# EAGLE design sequencer_gate_LED_addon (EAGLE 5.07)
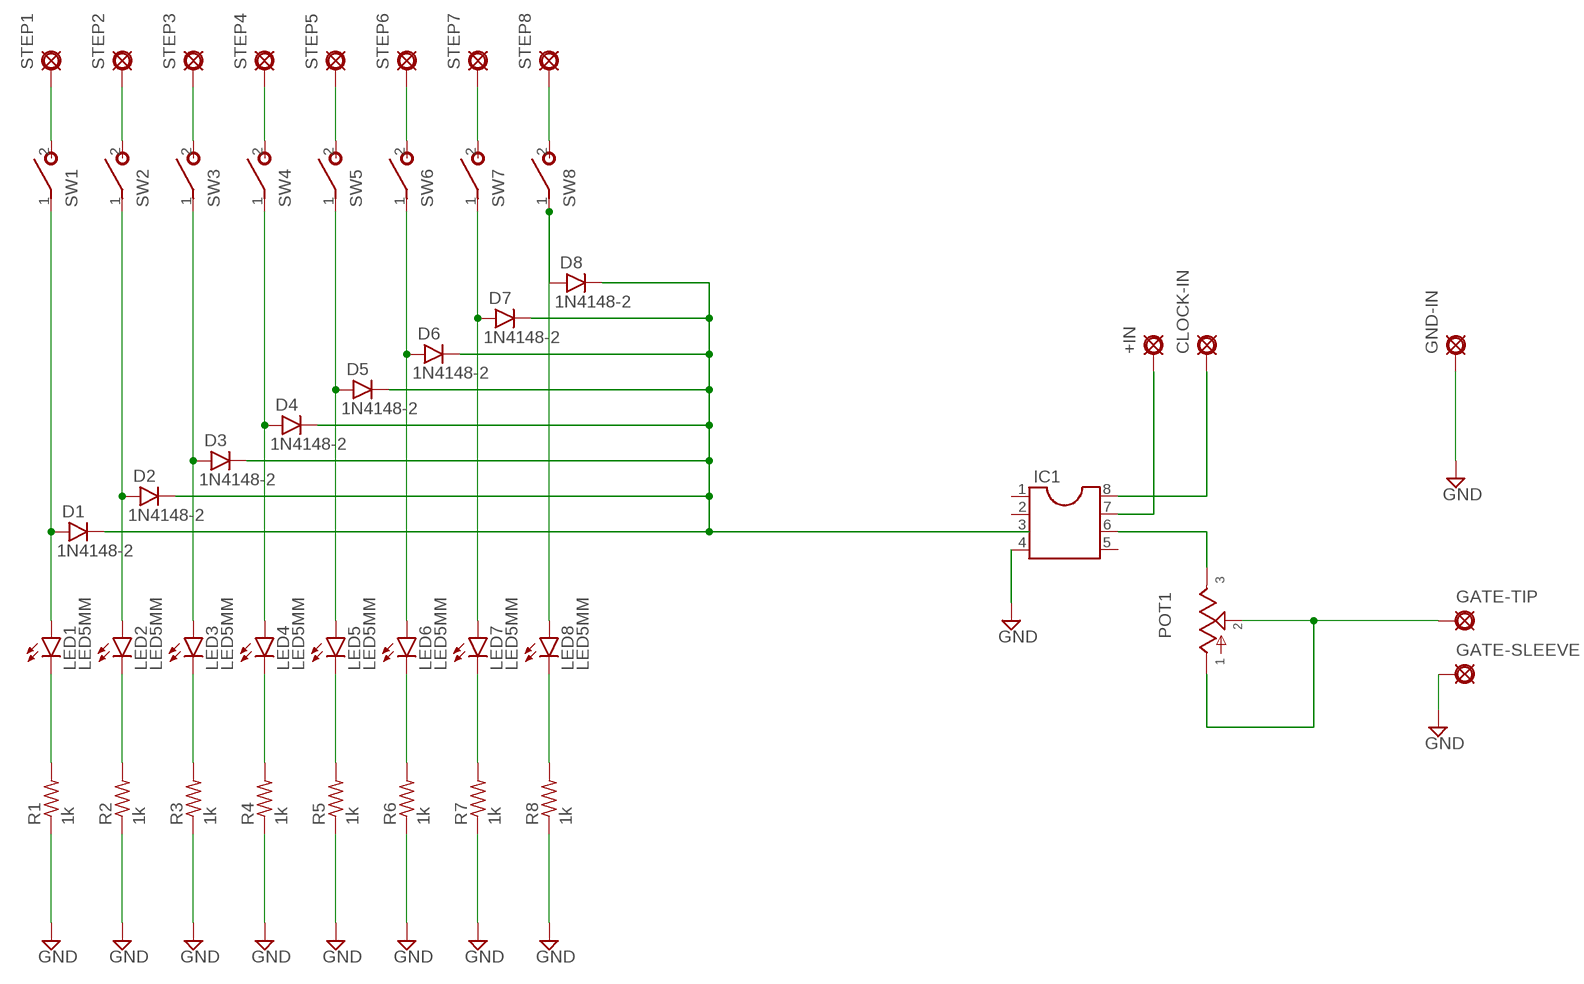
[diagram p0: schematic, sheet 1]

## Parts
+IN  PAD  [SQUARE]
CLOCK-IN  PAD  [SQUARE]
D1  1N4148-2  [DO35-2]
D2  1N4148-2  [DO35-2]
D3  1N4148-2  [DO35-2]
D4  1N4148-2  [DO35-2]
D5  1N4148-2  [DO35-2]
D6  1N4148-2  [DO35-2]
D7  1N4148-2  [DO35-2]
D8  1N4148-2  [DO35-2]
GATE-SLEEVE  PAD8  [OCTOGON]
GATE-TIP  PAD  [SQUARE]
GND-IN  PAD8  [OCTOGON]
IC1  DIL8  [DIL08]
LED1  LED5MM  [LED5MM]
LED2  LED5MM  [LED5MM]
LED3  LED5MM  [LED5MM]
LED4  LED5MM  [LED5MM]
LED5  LED5MM  [LED5MM]
LED6  LED5MM  [LED5MM]
LED7  LED5MM  [LED5MM]
LED8  LED5MM  [LED5MM]
POT1  POT  [POT]
R1  1k  3MM.2  [R0204/2]
R2  1k  3MM.2  [R0204/2]
R3  1k  3MM.2  [R0204/2]
R4  1k  3MM.2  [R0204/2]
R5  1k  3MM.2  [R0204/2]
R6  1k  3MM.2  [R0204/2]
R7  1k  3MM.2  [R0204/2]
R8  1k  3MM.2  [R0204/2]
STEP1  PAD  [SQUARE]
STEP2  PAD  [SQUARE]
STEP3  PAD  [SQUARE]
STEP4  PAD  [SQUARE]
STEP5  PAD  [SQUARE]
STEP6  PAD  [SQUARE]
STEP7  PAD  [SQUARE]
STEP8  PAD  [SQUARE]
SW1  SPST  [SPST]
SW2  SPST  [SPST]
SW3  SPST  [SPST]
SW4  SPST  [SPST]
SW5  SPST  [SPST]
SW6  SPST  [SPST]
SW7  SPST  [SPST]
SW8  SPST  [SPST]

## Nets
D10: D2.A LED2.A SW2.1(P)
GND: GATE-SLEEVE.1(PAD) GND-IN.1(PAD) IC1.4 R1.1 R2.1 R3.1 R4.1 R5.1 R6.1 R7.1 R8.1
N$1: STEP3.1(PAD) SW3.2(S)
N$2: D3.A LED3.A SW3.1(P)
N$3: LED3.K(C) R3.2
N$4: STEP4.1(PAD) SW4.2(S)
N$5: D4.A LED4.A SW4.1(P)
N$6: LED4.K(C) R4.2
N$7: STEP5.1(PAD) SW5.2(S)
N$8: D5.A LED5.A SW5.1(P)
N$9: LED5.K(C) R5.2
N$10: STEP6.1(PAD) SW6.2(S)
N$11: D6.A LED6.A SW6.1(P)
N$12: LED6.K(C) R6.2
N$13: STEP7.1(PAD) SW7.2(S)
N$14: D7.A LED7.A SW7.1(P)
N$15: LED7.K(C) R7.2
N$16: STEP8.1(PAD) SW8.2(S)
N$17: D8.A LED8.A SW8.1(P)
N$18: LED8.K(C) R8.2
N$19: STEP1.1(PAD) SW1.2(S)
N$20: D1.A LED1.A SW1.1(P)
N$21: LED1.K(C) R1.2
N$22: STEP2.1(PAD) SW2.2(S)
N$24: LED2.K(C) R2.2
N$25: D1.C D2.C D3.C D4.C D5.C D6.C D7.C D8.C IC1.3
N$26: +IN.1(PAD) IC1.7
N$28: IC1.6 POT1.3
N$29: GATE-TIP.1(PAD) POT1.1 POT1.2
N$30: CLOCK-IN.1(PAD) IC1.8
Unconnected: IC1.1 IC1.2 IC1.5

## Library data of the parts
+IN CLOCK-IN GATE-SLEEVE GATE-TIP GND-IN STEP1-STEP8 = gm-supply:PAD: PAD use this package for pads with any purpose, including input, output, send or return various pad shapes: round, square, octogonal, long, and long offset
D1-D8 = gm-diodes:1N4148: Fast Switching Diode DO-35 glass case a.k.a. 1N914
IC1 = gm-ics:DIL8: Dual In Line
LED1-LED8 = gm-diodes:LED
POT1 = gm-pots:POT: Potentiometers the arrow indicates the clockwise motion of th wiper (lug 2) fully counter clockwise there is no resistance between lugs 1 and 2 fully clockwise the resistance between lugs 1 and 2 is the value of the pot
R1-R8 = gm-resistors:3MM: 3mm Resistors Leads spaced 1-6 holes apart for 0.1" perfboard. Suitable for 1/8 watt resistors.
SW1-SW8 = gm-switches:SPST

## Board
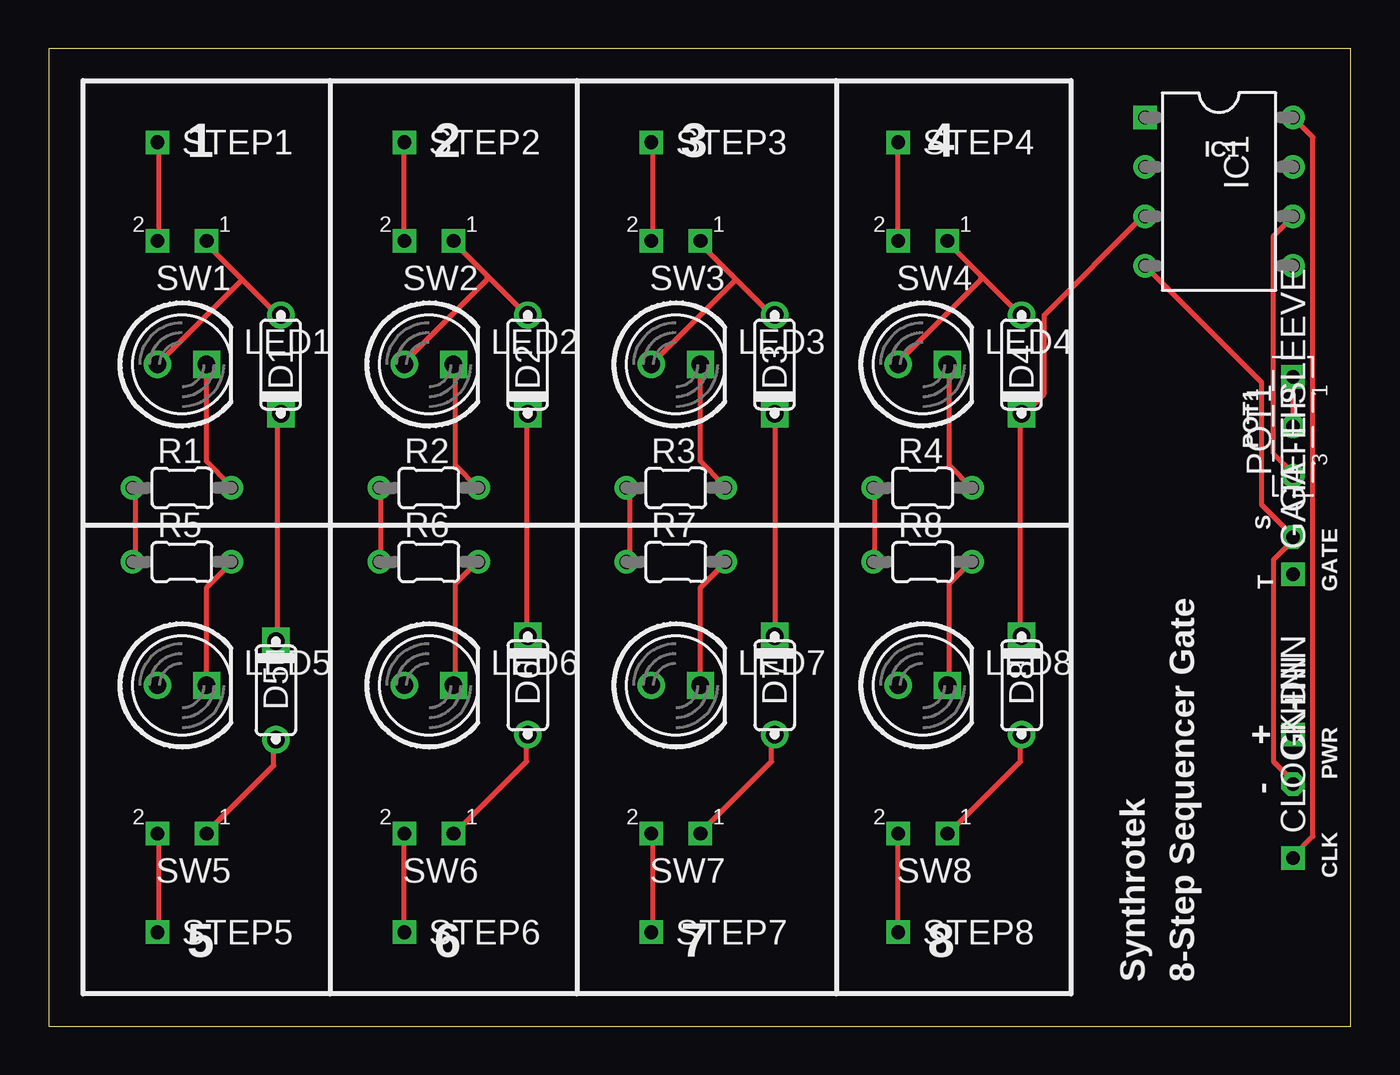
[diagram p1: board, top side]
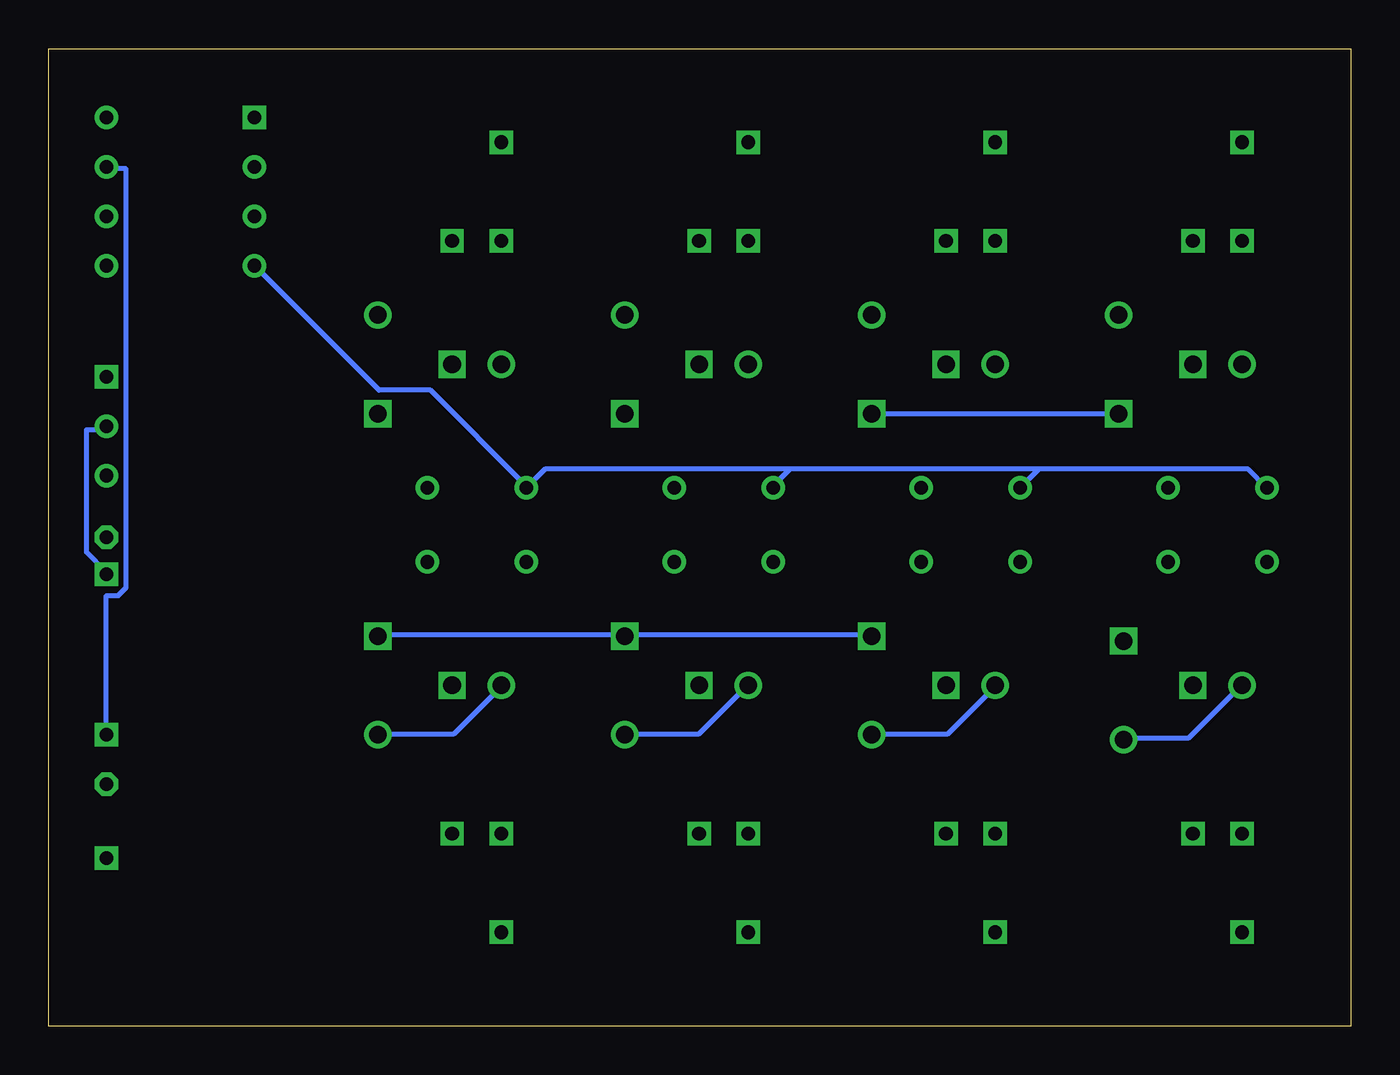
[diagram p2: board, bottom side, seen from below]

Size 66.98 x 50.28 mm. Coordinates in mm from the lower left corner, seen from the top.
Outline: 0,0 66.98,0 66.98,50.28 0,50.28 0,0
Copper layers (1*16): Top 0.035mm / dielectric 1.5mm / Bottom 0.035mm
Design rules "default": minimum track width 10mil, minimum drill 24mil, track to track 8mil, track to pad 8mil, pad to pad 8mil, via to via 8mil, smd to smd 8mil, copper to edge 40mil, drill to drill 8mil, minimum pad ring 10mil, minimum via ring 8mil, stop-mask expansion 4mil, vias tented up to drill 0mil, thermal gap 10mil

### Footprints (pad centres in the part's own frame; a part is rotated, then mirrored left to right if it is on the bottom)
SQUARE = drill 0.7 square: 1 0,0
DO35-2 = drill 0.9 round: A 2.54,0 | drill 0.9 square: C -2.54,0
OCTOGON = drill 0.7 octagon: 1 0,0
DIL08 = drill 0.7 square: 1 -3.81,-3.81 | drill 0.7 round: 2 -1.27,-3.81; 3 1.27,-3.81; 4 3.81,-3.81; 5 3.81,3.81; 6 1.27,3.81; 7 -1.27,3.81; 8 -3.81,3.81
LED5MM = drill 0.9 round: A -1.27,0 | drill 0.9 square: K 1.27,0
POT = drill 0.7 square: 1 2.54,0 | drill 0.7 round: 2 0,0; 3 -2.54,0
R0204/2 = drill 0.7 round: 1 -2.54,0; 2 2.54,0
SPST = drill 0.7 square: 1 -1.27,0; 2 1.27,0

### Placement (x,y rotation side)
+IN  64.01,14.99 90 top
CLOCK-IN  64.01,8.64 90 top
D1  11.94,34.04 90 top
D2  24.64,34.04 90 top
D3  37.34,34.04 90 top
D4  50.04,34.04 90 top
D5  11.68,17.27 270 top
D6  24.64,17.53 270 top
D7  37.34,17.53 270 top
D8  50.04,17.53 270 top
GATE-SLEEVE  64.01,25.15 90 top
GATE-TIP  64.01,23.24 90 top
GND-IN  64.01,12.45 90 top
IC1  60.2,42.93 270 top
LED1  6.86,34.04 0 top
LED2  19.56,34.04 0 top
LED3  32.26,34.04 0 top
LED4  44.96,34.04 0 top
LED5  6.86,17.53 0 top
LED6  19.56,17.53 0 top
LED7  32.26,17.53 0 top
LED8  44.96,17.53 0 top
POT1  64.01,30.86 90 top
R1  6.86,27.69 0 top
R2  19.56,27.69 0 top
R3  32.26,27.69 0 top
R4  44.96,27.69 0 top
R5  6.86,23.88 0 top
R6  19.56,23.88 0 top
R7  32.26,23.88 0 top
R8  44.96,23.88 0 top
STEP1  5.59,45.47 0 top
STEP2  18.29,45.47 0 top
STEP3  30.99,45.47 0 top
STEP4  43.69,45.47 0 top
STEP5  5.59,4.83 0 top
STEP6  18.29,4.83 0 top
STEP7  30.99,4.83 0 top
STEP8  43.69,4.83 0 top
SW1  6.86,40.39 180 top
SW2  19.56,40.39 180 top
SW3  32.26,40.39 180 top
SW4  44.96,40.39 180 top
SW5  6.86,9.91 180 top
SW6  19.56,9.91 180 top
SW7  32.26,9.91 180 top
SW8  44.96,9.91 180 top

### Tracks (layer width: path | path; a pad name or v marks a point on that pad's centre or on a via)
D10
  Top 0.254: 22.55,38.61 24.59,36.58 D2.A | 22.55,38.61 20.93,40.23 SW2.1 | 22.55,38.61 22.55,38.41 18.29,34.14 LED2.A
GND
  Top 0.254: GND-IN.1 64.01,12.6 62.99,13.61 62.99,23.98 64.01,24.99 GATE-SLEEVE.1 64.01,25.2 62.38,26.82 62.38,33.12 IC1.4 | R8.1 42.47,23.98 42.47,27.64 R4.1 | R7.1 29.87,23.98 29.87,27.64 R3.1 | R5.1 4.47,23.98 4.47,27.64 R1.1 | R6.1 17.07,23.98 17.07,27.64 R2.1
  Bottom 0.254: 16.05,28.65 5.28,28.65 R1.1 | 16.05,28.65 R2.1 | 28.85,28.65 29.67,27.84 R3.1 | 16.05,28.65 28.85,28.65 | 28.85,28.65 41.45,28.65 R4.1 42.47,27.84 47.35,32.72 49.99,32.72 IC1.4
N$1
  Top 0.254: SW3.2 31.09,40.44 31.09,45.31 STEP3.1
N$2
  Top 0.254: 35.36,38.41 37.19,36.58 D3.A | 35.36,38.41 33.53,40.23 SW3.1 | LED3.A 35.36,38.41
N$3
  Top 0.254: R3.2 34.75,27.84 33.53,29.06 LED3.K
N$4
  Top 0.254: SW4.2 STEP4.1
N$5
  Top 0.254: 47.95,38.61 49.99,36.58 D4.A | 47.95,38.61 46.33,40.23 SW4.1 | 47.95,38.61 47.95,38.41 43.69,34.14 LED4.A
N$6
  Top 0.254: R4.2 46.33,28.85 46.33,33.93 LED4.K
N$7
  Top 0.254: STEP5.1 5.69,4.88 5.69,9.75 SW5.2
N$8
  Top 0.254: SW5.1 8.13,9.96 11.58,13.41 11.58,14.63 D5.A
  Bottom 0.254: LED5.A 5.69,17.48 8.33,14.83 11.58,14.83 D5.A
N$9
  Top 0.254: R5.2 9.35,23.77 8.13,22.55 LED5.K
N$10
  Top 0.254: STEP6.1 SW6.2
N$11
  Top 0.254: SW6.1 20.93,9.96 24.59,13.61 24.59,14.83 D6.A
  Bottom 0.254: LED6.A 18.29,17.48 20.73,15.04 24.59,15.04 D6.A
N$12
  Top 0.254: R6.2 21.95,23.77 20.93,22.76 20.93,17.68 LED6.K
N$13
  Top 0.254: STEP7.1 31.09,4.88 31.09,9.75 SW7.2
N$14
  Top 0.254: SW7.1 33.53,9.96 37.19,13.61 37.19,14.83 D7.A
  Bottom 0.254: LED7.A 31.09,17.48 33.53,15.04 37.19,15.04 D7.A
N$15
  Top 0.254: R7.2 34.75,23.77 33.53,22.55 LED7.K
N$16
  Top 0.254: STEP8.1 SW8.2
N$17
  Top 0.254: SW8.1 46.33,9.96 49.99,13.61 49.99,14.83 D8.A
  Bottom 0.254: LED8.A 43.69,17.48 46.13,15.04 49.99,15.04 D8.A
N$18
  Top 0.254: R8.2 47.35,23.77 46.33,22.76 46.33,17.68 LED8.K
N$19
  Top 0.254: SW1.2 5.69,40.44 5.69,45.31 STEP1.1
N$20
  Top 0.254: 9.96,38.41 11.79,36.58 D1.A | 9.96,38.41 8.13,40.23 SW1.1 | LED1.A 9.96,38.41
N$21
  Top 0.254: R1.2 9.35,27.84 8.13,29.06 LED1.K
N$22
  Top 0.254: SW2.2 STEP2.1
N$24
  Top 0.254: R2.2 20.93,28.85 20.93,33.93 LED2.K
N$25
  Top 0.254: IC1.3 56.29,41.66 51.21,36.58 51.21,32.51 50.19,31.5 D4.C 49.99,31.5 49.99,20.12 D8.C | D5.C 11.79,19.91 11.79,31.5 D1.C | D6.C 24.59,20.12 24.59,31.5 D2.C | D7.C 37.39,20.12 37.39,31.5 D3.C
  Bottom 0.254: D6.C 24.79,20.12 37.19,20.12 D7.C 37.39,20.12 49.99,20.12 D8.C | D1.C D2.C
N$26
  Bottom 0.254: +IN.1 64.01,22.15 63.4,22.15 62.99,22.55 62.99,44.09 64.01,44.09 IC1.7
N$28
  Top 0.254: IC1.6 62.99,40.64 62.99,29.46 64.01,28.45 POT1.3
N$29
  Top 0.254: POT1.2 POT1.1
  Bottom 0.254: GATE-TIP.1 64.01,23.37 65.02,24.38 65.02,30.68 64.01,30.68 POT1.2
N$30
  Top 0.254: IC1.8 65.02,45.72 65.02,9.75 64.01,8.74 CLOCK-IN.1

### Text on the board
tPlace: 1 | 2 | 3 | 4 | IC1 | POT1 | S | T | GATE | + | PWR | - | CLK | 5 | 6 | 7 | 8 | Synthrotek | 8-Step Sequencer Gate